# Altium schematic sheet 03_ATSAM3X_LFBGA217.SchDoc
size 420 x 297 mm
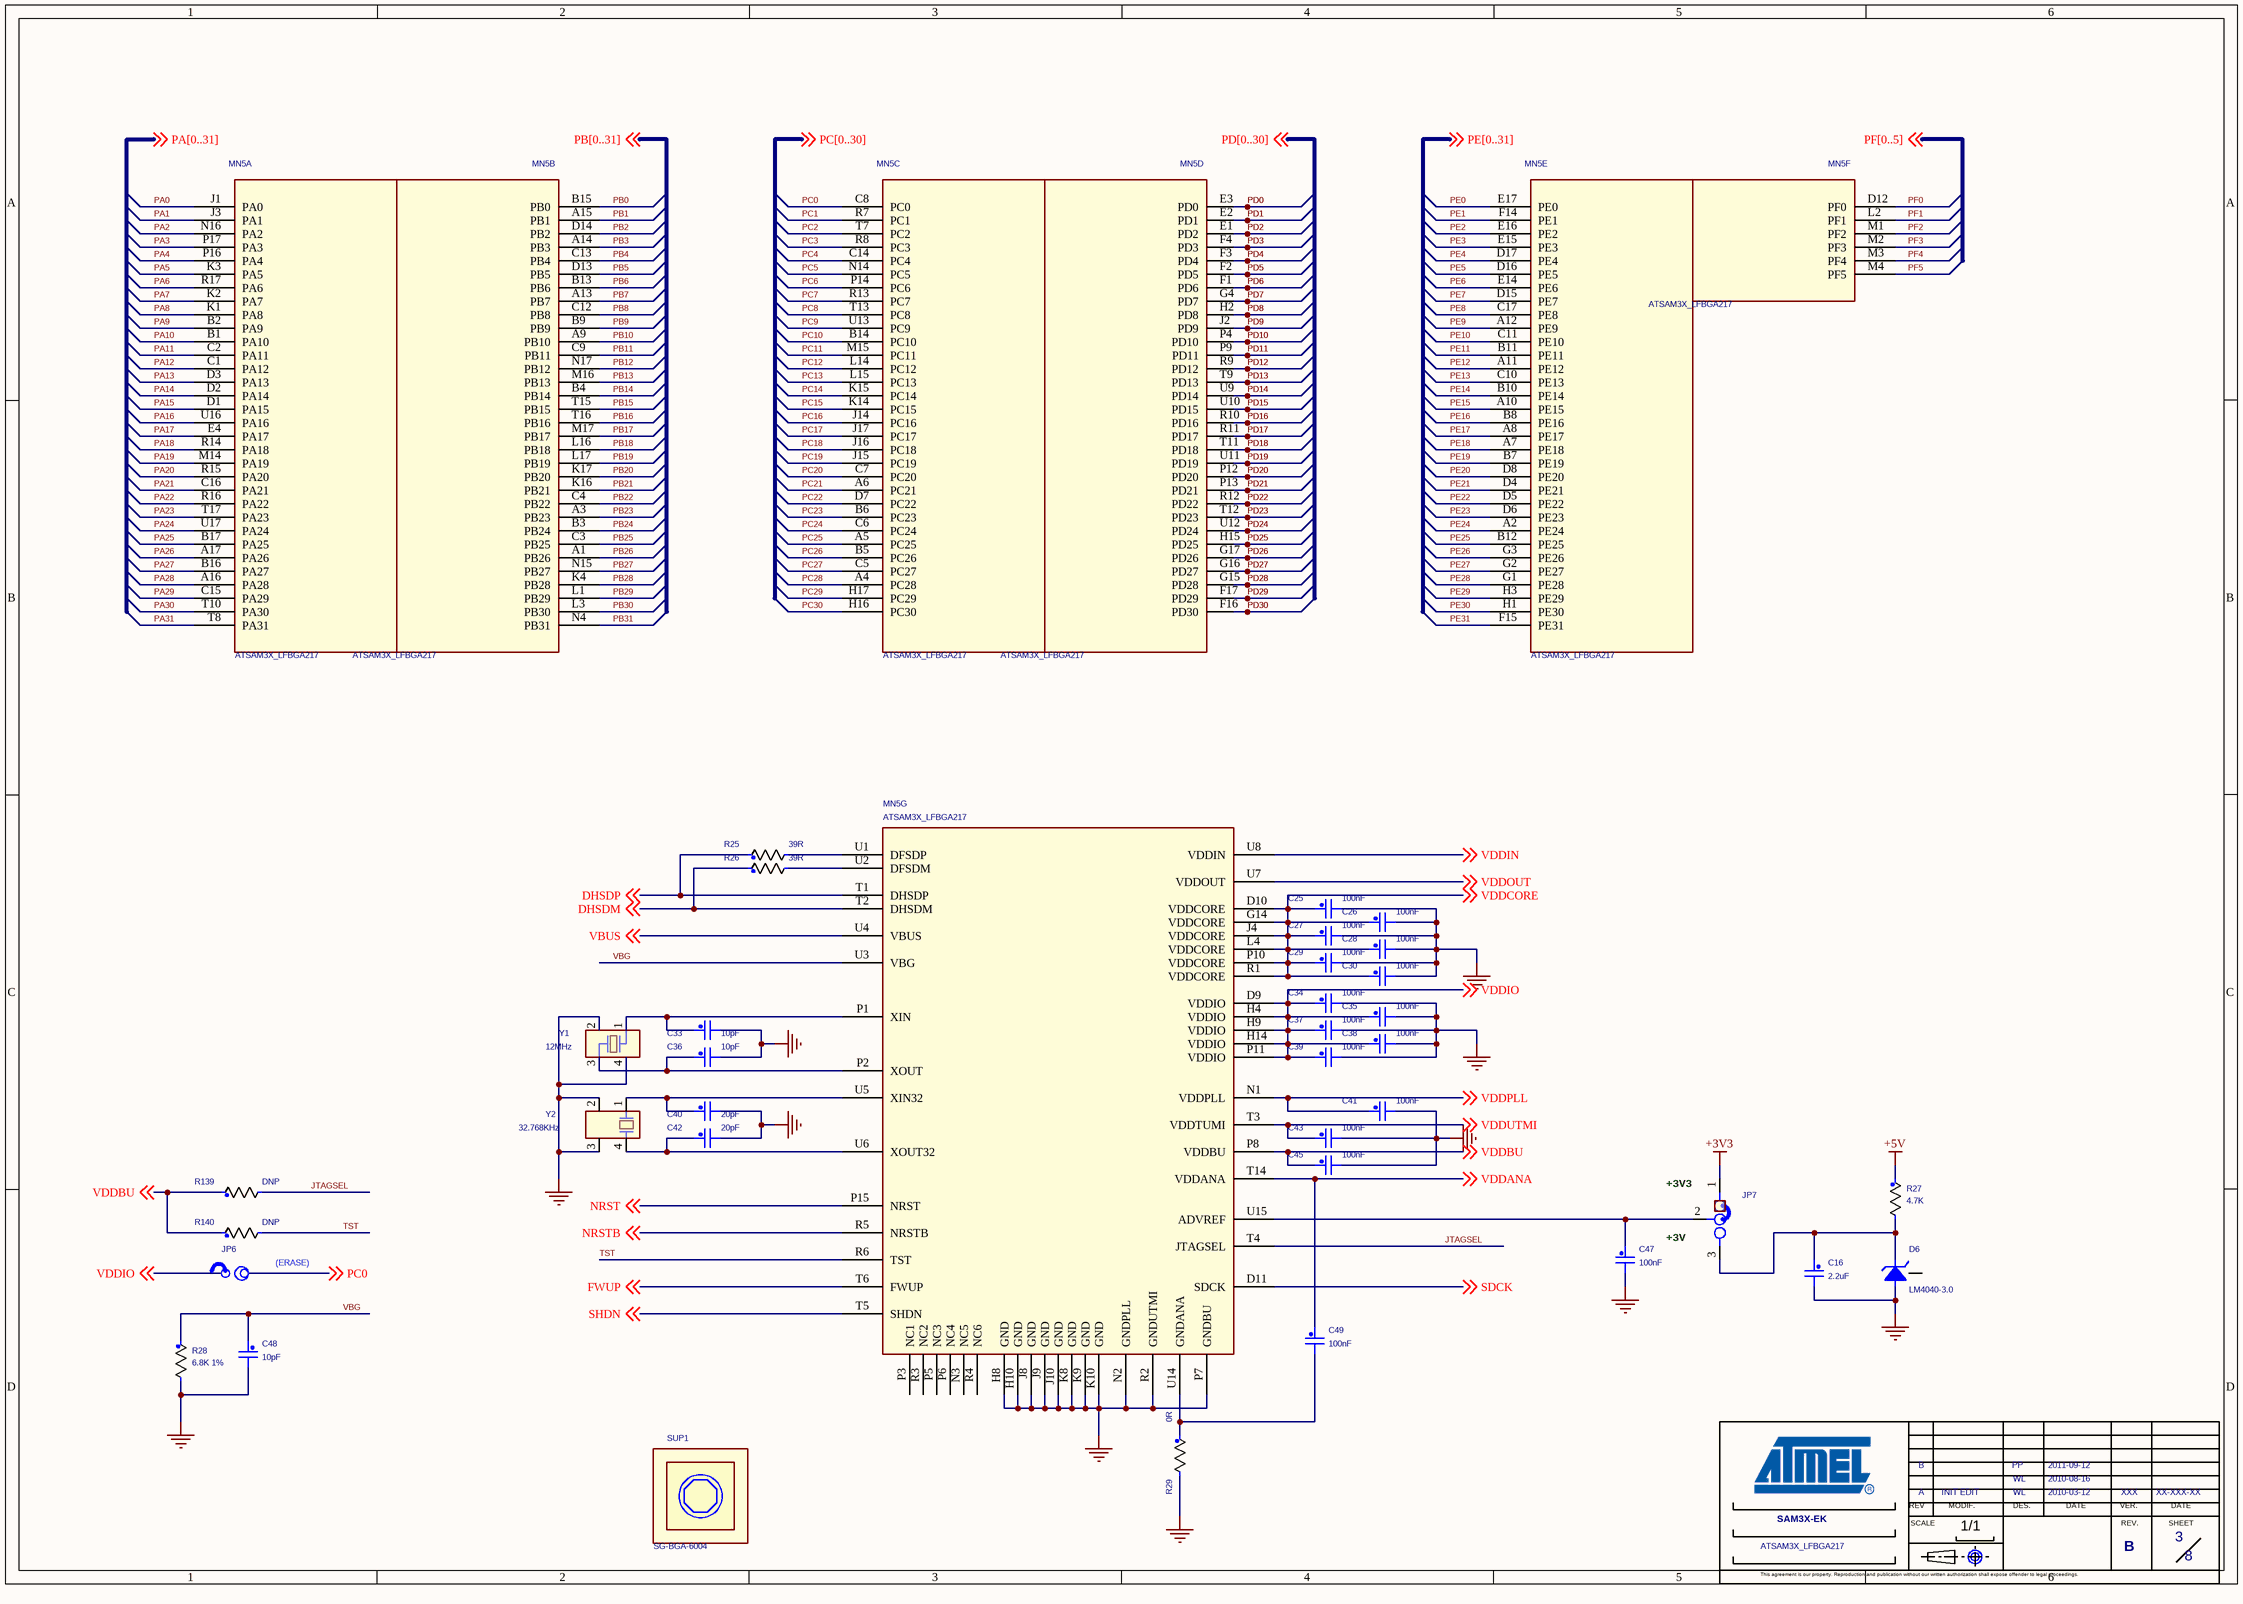
[diagram p0: 03_ATSAM3X_LFBGA217.SchDoc]

## Parts
*  SHEET NAME 1: ATSAM3X_LFBGA217  REV C: B  VERIF A: XXX  VERIF DATE A: XX-XXX-XX  Page Count: 8  Page Number: 3  DATE A: 2010-03-12  DATE B: 2010-08-16  DATE C: 2011-09-12  DES A: WL  DES C: PP  BOARD NAME: SAM3X-EK  VERSION: A  MODIF. DESCRIBE: INIT EDIT  (hidden comment: ATMEL ARM)  (graphical)
C16  2.2uF  [CAP0805]
C25  100nF  [CAP0805]
C26  100nF  [CAP0805]
C27  100nF  [CAP0805]
C28  100nF  [CAP0805]
C29  100nF  [CAP0805]
C30  100nF  [CAP0805]
C33  10pF  [CAP0805]
C34  100nF  [CAP0805]
C35  100nF  [CAP0805]
C36  10pF  [CAP0805]
C37  100nF  [CAP0805]
C38  100nF  [CAP0805]
C39  100nF  [CAP0805]
C40  20pF  [CAP0805]
C41  100nF  [CAP0805]
C42  20pF  [CAP0805]
C43  100nF  [CAP0805]
C45  100nF  [CAP0805]
C47  100nF  [CAP0805]
C48  10pF  [CAP0805]
C49  100nF  [CAP0805]
D6  LM4040-3.0  [SOT-23]
JP6  JP  [BAR2PTS02]  (value not drawn)
JP7  header3-100  [BAR3PTS02]  (value not drawn)
MN5  ATSAM3X_LFBGA217  [LFBGA217]  (parts A,B,C,D,E,F,G of 7)
R25  39R  [R0603]
R26  39R  [R0603]
R27  4.7K  [R0603]
R28  6.8K 1%  [R0603]
R29  0R  [r0603]
R139  DNP  [r0603]
R140  DNP  [r0603]
SH12  Jumper Pitch 2.54  [JUMPER-2.54]  (value not drawn)
SH13  Jumper Pitch 2.54  [JUMPER-2.54]  (value not drawn)
SUP1  VAL: SG-BGA-6004  (hidden comment: Support_SG-BGA-6004-MF)
Y1  12MHz  [Y6035]
Y2  32.768KHz  [9H-T7]

## Nets
+3V3: JP7.1
+5V: R27.1
GND_POWER: C16.2 C25.2 C26.2 C27.2 C28.2 C29.2 C30.2 C33.2 C34.2 C35.2 C36.2 C37.2 C38.2 C39.2 C40.2 C41.2 C42.2 C43.2 C45.2 C47.2 C48.2 D6.2(-) MN5.H8(GND) MN5.H10(GND) MN5.J8(GND) MN5.J9(GND) MN5.J10(GND) MN5.K8(GND) MN5.K9(GND) MN5.K10(GND) MN5.N2(GNDPLL) MN5.P7(GNDBU) MN5.R2(GNDUTMI) R28.2 R29.2 Y1.2 Y1.4 Y2.2 Y2.3
DHSDM: MN5.T2(DHSDM) R26.1 ; off-sheet DHSDM
DHSDP: MN5.T1(DHSDP) R25.1 ; off-sheet DHSDP
FWUP: MN5.T6(FWUP) ; off-sheet FWUP
JTAGSEL: MN5.T4(JTAGSEL) R139.2
NRST: MN5.P15(NRST) ; off-sheet NRST
NRSTB: MN5.R5(NRSTB) ; off-sheet NRSTB
PA0: MN5.J1(PA0)
PA1: MN5.J3(PA1)
PA2: MN5.N16(PA2)
PA3: MN5.P17(PA3)
PA4: MN5.P16(PA4)
PA5: MN5.K3(PA5)
PA6: MN5.R17(PA6)
PA7: MN5.K2(PA7)
PA8: MN5.K1(PA8)
PA9: MN5.B2(PA9)
PA10: MN5.B1(PA10)
PA11: MN5.C2(PA11)
PA12: MN5.C1(PA12)
PA13: MN5.D3(PA13)
PA14: MN5.D2(PA14)
PA15: MN5.D1(PA15)
PA16: MN5.U16(PA16)
PA17: MN5.E4(PA17)
PA18: MN5.R14(PA18)
PA19: MN5.M14(PA19)
PA20: MN5.R15(PA20)
PA21: MN5.C16(PA21)
PA22: MN5.R16(PA22)
PA23: MN5.T17(PA23)
PA24: MN5.U17(PA24)
PA25: MN5.B17(PA25)
PA26: MN5.A17(PA26)
PA27: MN5.B16(PA27)
PA28: MN5.A16(PA28)
PA29: MN5.C15(PA29)
PA30: MN5.T10(PA30)
PA31: MN5.T8(PA31)
PB0: MN5.B15(PB0)
PB1: MN5.A15(PB1)
PB2: MN5.D14(PB2)
PB3: MN5.A14(PB3)
PB4: MN5.C13(PB4)
PB5: MN5.D13(PB5)
PB6: MN5.B13(PB6)
PB7: MN5.A13(PB7)
PB8: MN5.C12(PB8)
PB9: MN5.B9(PB9)
PB10: MN5.A9(PB10)
PB11: MN5.C9(PB11)
PB12: MN5.N17(PB12)
PB13: MN5.M16(PB13)
PB14: MN5.B4(PB14)
PB15: MN5.T15(PB15)
PB16: MN5.T16(PB16)
PB17: MN5.M17(PB17)
PB18: MN5.L16(PB18)
PB19: MN5.L17(PB19)
PB20: MN5.K17(PB20)
PB21: MN5.K16(PB21)
PB22: MN5.C4(PB22)
PB23: MN5.A3(PB23)
PB24: MN5.B3(PB24)
PB25: MN5.C3(PB25)
PB26: MN5.A1(PB26)
PB27: MN5.N15(PB27)
PB28: MN5.K4(PB28)
PB29: MN5.L1(PB29)
PB30: MN5.L3(PB30)
PB31: MN5.N4(PB31)
PC0: JP6.1 MN5.C8(PC0) ; off-sheet PC0
PC1: MN5.R7(PC1)
PC2: MN5.T7(PC2)
PC3: MN5.R8(PC3)
PC4: MN5.C14(PC4)
PC5: MN5.N14(PC5)
PC6: MN5.P14(PC6)
PC7: MN5.R13(PC7)
PC8: MN5.T13(PC8)
PC9: MN5.U13(PC9)
PC10: MN5.B14(PC10)
PC11: MN5.M15(PC11)
PC12: MN5.L14(PC12)
PC13: MN5.L15(PC13)
PC14: MN5.K15(PC14)
PC15: MN5.K14(PC15)
PC16: MN5.J14(PC16)
PC17: MN5.J17(PC17)
PC18: MN5.J16(PC18)
PC19: MN5.J15(PC19)
PC20: MN5.C7(PC20)
PC21: MN5.A6(PC21)
PC22: MN5.D7(PC22)
PC23: MN5.B6(PC23)
PC24: MN5.C6(PC24)
PC25: MN5.A5(PC25)
PC26: MN5.B5(PC26)
PC27: MN5.C5(PC27)
PC28: MN5.A4(PC28)
PC29: MN5.H17(PC29)
PC30: MN5.H16(PC30)
PD0: MN5.E3(PD0)
PD1: MN5.E2(PD1)
PD2: MN5.E1(PD2)
PD3: MN5.F4(PD3)
PD4: MN5.F3(PD4)
PD5: MN5.F2(PD5)
PD6: MN5.F1(PD6)
PD7: MN5.G4(PD7)
PD8: MN5.H2(PD8)
PD9: MN5.J2(PD9)
PD10: MN5.P4(PD10)
PD11: MN5.P9(PD11)
PD12: MN5.R9(PD12)
PD13: MN5.T9(PD13)
PD14: MN5.U9(PD14)
PD15: MN5.U10(PD15)
PD16: MN5.R10(PD16)
PD17: MN5.R11(PD17)
PD18: MN5.T11(PD18)
PD19: MN5.U11(PD19)
PD20: MN5.P12(PD20)
PD21: MN5.P13(PD21)
PD22: MN5.R12(PD22)
PD23: MN5.T12(PD23)
PD24: MN5.U12(PD24)
PD25: MN5.H15(PD25)
PD26: MN5.G17(PD26)
PD27: MN5.G16(PD27)
PD28: MN5.G15(PD28)
PD29: MN5.F17(PD29)
PD30: MN5.F16(PD30)
PE0: MN5.E17(PE0)
PE1: MN5.F14(PE1)
PE2: MN5.E16(PE2)
PE3: MN5.E15(PE3)
PE4: MN5.D17(PE4)
PE5: MN5.D16(PE5)
PE6: MN5.E14(PE6)
PE7: MN5.D15(PE7)
PE8: MN5.C17(PE8)
PE9: MN5.A12(PE9)
PE10: MN5.C11(PE10)
PE11: MN5.B11(PE11)
PE12: MN5.A11(PE12)
PE13: MN5.C10(PE13)
PE14: MN5.B10(PE14)
PE15: MN5.A10(PE15)
PE16: MN5.B8(PE16)
PE17: MN5.A8(PE17)
PE18: MN5.A7(PE18)
PE19: MN5.B7(PE19)
PE20: MN5.D8(PE20)
PE21: MN5.D4(PE21)
PE22: MN5.D5(PE22)
PE23: MN5.D6(PE23)
PE24: MN5.A2(PE24)
PE25: MN5.B12(PE25)
PE26: MN5.G3(PE26)
PE27: MN5.G2(PE27)
PE28: MN5.G1(PE28)
PE29: MN5.H3(PE29)
PE30: MN5.H1(PE30)
PE31: MN5.F15(PE31)
PF0: MN5.D12(PF0)
PF1: MN5.L2(PF1)
PF2: MN5.M1(PF2)
PF3: MN5.M2(PF3)
PF4: MN5.M3(PF4)
PF5: MN5.M4(PF5)
SDCK: MN5.D11(SDCK) ; off-sheet SDCK
SHDN: MN5.T5(SHDN) ; off-sheet SHDN
TST: MN5.R6(TST) R140.2
VBG: C48.1 MN5.U3(VBG) R28.1
VBUS: MN5.U4(VBUS) ; off-sheet VBUS
VDDANA: C49.1 MN5.T14(VDDANA) ; off-sheet VDDANA
VDDBU: C45.1 MN5.P8(VDDBU) R139.1 R140.1 ; off-sheet VDDBU
VDDCORE: C25.1 C26.1 C27.1 C28.1 C29.1 C30.1 MN5.D10(VDDCORE) MN5.G14(VDDCORE) MN5.J4(VDDCORE) MN5.L4(VDDCORE) MN5.P10(VDDCORE) MN5.R1(VDDCORE) ; off-sheet VDDCORE
VDDIN: MN5.U8(VDDIN) ; off-sheet VDDIN
VDDIO: C34.1 C35.1 C37.1 C38.1 C39.1 JP6.2 MN5.D9(VDDIO) MN5.H4(VDDIO) MN5.H9(VDDIO) MN5.H14(VDDIO) MN5.P11(VDDIO) ; off-sheet VDDIO
VDDOUT: MN5.U7(VDDOUT) ; off-sheet VDDOUT
VDDPLL: C41.1 MN5.N1(VDDPLL) ; off-sheet VDDPLL
VDDUTMI: C43.1 MN5.T3(VDDTUMI) ; off-sheet VDDUTMI
NetC16_1: C16.1 D6.1(+) JP7.3 R27.2
NetC33_1: C33.1 MN5.P1(XIN) Y1.1
NetC36_1: C36.1 MN5.P2(XOUT) Y1.3
NetC40_1: C40.1 MN5.U5(XIN32) Y2.1
NetC42_1: C42.1 MN5.U6(XOUT32) Y2.4
NetC47_1: C47.1 JP7.2 MN5.U15(ADVREF)
NetC49_2: C49.2 MN5.U14(GNDANA) R29.1
NetMN5_U1: MN5.U1(DFSDP) R25.2
NetMN5_U2: MN5.U2(DFSDM) R26.2

Not connected (* = marked no-connect by the designer): D6 3(NC); MN5 N3(NC5) P3(NC1) P5(NC3) P6(NC4) R3(NC2) R4(NC6)

## Notes on the sheet
- (near JP7) +3V3
- (ERASE)
- (near JP7) +3V
- (in symbol ATMEL ARM) REV; MODIF.; DES.; DATE; VER.; SCALE; REV.; SHEET; 1/1; This agreement is our property. Reproduction and publication without our written authorization shall expose offender to legal proceedings.

## Library data of the parts
* = ATMEL ARM: REV D: D; REV F: F; REV E: E; REV B: B; VERIF F: XXX; VERIF E: XXX; VERIF D: XXX; VERIF C: XXX; VERIF B: XXX; VERIF DATE F: XX-XXX-XX; VERIF DATE E: XX-XXX-XX; VERIF DATE D: XX-XXX-XX; VERIF DATE C: XX-XXX-XX; REV: B; VERIF DATE B: XX-XXX-XX; FT: ?; Page Size: A; Page Create Date: june 19, 2004; DATE D: XX-XXX-XX; DATE E: XX-XXX-XX; DATE F: XX-XXX-XX; DES E: XXX; DES F: XXX; DES B: WL; DES D: XXX
C16 = C_Generic: Toler.: 10%; P/N #1: C0603C104K4RAC; Voltage: 50V; Mfg #1: KEMET; Dielectric: X5R; REF: C2012X5R1C225KT; FAB: TDK; DEV: C0805; DESIG: X5R CERAMIC CAPACITOR; BOI: 0805; TOL: 10%; TEN: 50V; VAL: 2.2uF
C25 C27 C29 C35 C38 C41 C43 C49 = C_Generic: Toler.: 10%; P/N #1: C0603C104K4RAC; Voltage: 16V; Mfg #1: KEMET; Dielectric: X7R; REF: C1608X7R1C104KT; FAB: TDK; DEV: C0603; DESIG: Ceramic Capacitor; BOI: 0603; TOL: 10%; TEN: 16V; VAL: 100nF
C26 C28 C30 C34 C37 C39 C45 C47 = C_Generic: Toler.: 10%; P/N #1: C0603C104K4RAC; Voltage: 16V; Mfg #1: KEMET; Dielectric: X7R; BOI: 0603; DESIG: Ceramic Capacitor; DEV: C0603; FAB: TDK; REF: C1608X7R1C104KT; VAL: 100nF; TEN: 16V; TOL: 10%
C33 C36 C48 = C_Generic: Toler.: 10%; P/N #1: C0603C104K4RAC; Voltage: 16V; Mfg #1: KEMET; Dielectric: X7R; BOI: 0603; DESIG: Ceramic capacitor; DEV: C0603; FAB: TDK; REF: C1608X7R1H100KT; TEN: 50V; VAL: 10pF; TOL: 10%
C40 C42 = C_Generic: Toler.: 10%; P/N #1: C0603C104K4RAC; Voltage: 16V; Mfg #1: KEMET; Dielectric: X7R; TEN: 50V; REF: C1608X7R1H200KT; FAB: TDK; DEV: C0603; DESIG: Ceramic capacitor; BOI: 0603; TOL: 10%; VAL: 20pF
D6 = LM4040: Note: 0603; VAL: LM4040AIM3X-3.0; DESIG: Precision Micropower Shunt Voltage Reference; FAB: National; DEV: SOT23; REF: LM4040AIM3X-3.0; BOI: SOT23
JP6 = JUMP_0: DESIG: 2.54mm Pin Header,Single Row,Straight/Right Angle(2pin); FAB: SHENZHEN SITUO; REF: 045; VAL: 045
JP7 = TSW 3PTS-DROIT_0: DESIG: Single Row Terminal Strips; BOI: TSW; FAB: SAMTEC; RoHS: YES; DEV: HEADER3-100; REF: header3-100; VAL: header3-100; PN: header3-100
R25 = R_Generic: Toler.: 1%; P/N #1: CR10-1001F-T; Mfg #1: AVX; TOL: 5%; REF: RC0603JR-0739RL; FAB: YAGEO; DESIG: RC21 5%; BOI: 0603; VAL: 39R; DEV: R0603
R26 = R_Generic: Toler.: 1%; P/N #1: CR10-1001F-T; Mfg #1: AVX; BOI: 0603; DESIG: RC21 5%; FAB: YAGEO; REF: RC0603JR-0739RL; TOL: 5%; DEV: R0603; VAL: 39R
R27 = R_Generic: P/N #1: CR10-1001F-T; BOI: 0603; DESIG: RC21 5%; FAB: YAGEO; REF: RC0603JR-074K7L; TOL: 5%; DEV: R0603; VAL: 4.7K
R28 = R_Generic: P/N #1: CR10-1001F-T; REF: RC0603FR-076K8L; FAB: YAGEO; DESIG: RC22H 1%; BOI: 0603; TOL: 1%; VAL: 6.8K; DEV: R0603
R29 = R_Generic: P/N #1: CR10-1001F-T; BOI: 0603; DESIG: RC21 5%; FAB: YAGEO; REF: RC0603JR-070RL; TOL: 5%; DEV: R0603; VAL: 0R
R139 R140 = R_Generic: P/N #1: CR10-1001F-T; TOL: 5%; VAL: NOT POPULATED; FAB: YAGEO; DESIG: RC21 5%; BOI: 0603; DEV: R0603
SH12 = JUMPER-2.54: Jumper,2 Points Jumper Pitch 2.54; Part Number: 440-00002-1; Manufacturer: WIESON; Manufacturer Part Number: G4160-1A60BF1U; FAB: NA; REF: JUMPER 2.54; DESIG: 2 POINTS JUMPER PITCH 2.54; VAL: JUMPER 2.54; BOI: NA; Part Type: Jumper
SH13 = JUMPER-2.54: Jumper,2 Points Jumper Pitch 2.54; Manufacturer Part Number: G4160-1A60BF1U; Manufacturer: WIESON; Part Number: 440-00002-1; FAB: NA; REF: JUMPER 2.54; DESIG: 2 POINTS JUMPER PITCH 2.54; VAL: JUMPER 2.54; BOI: NA; Part Type: Jumper
SUP1 = Support_SG-BGA-6004-MF: FAB: Ironwood Electronics; BOI: Voir Specif. Techniq; DESIG: BGA Sockets-0.8mm; REF: SG-BGA-6004-MF
Y1 = 12MHz: FAB: ECEC; REF: K12000L035
Y2 = 32.768KHz: FAB: TXC